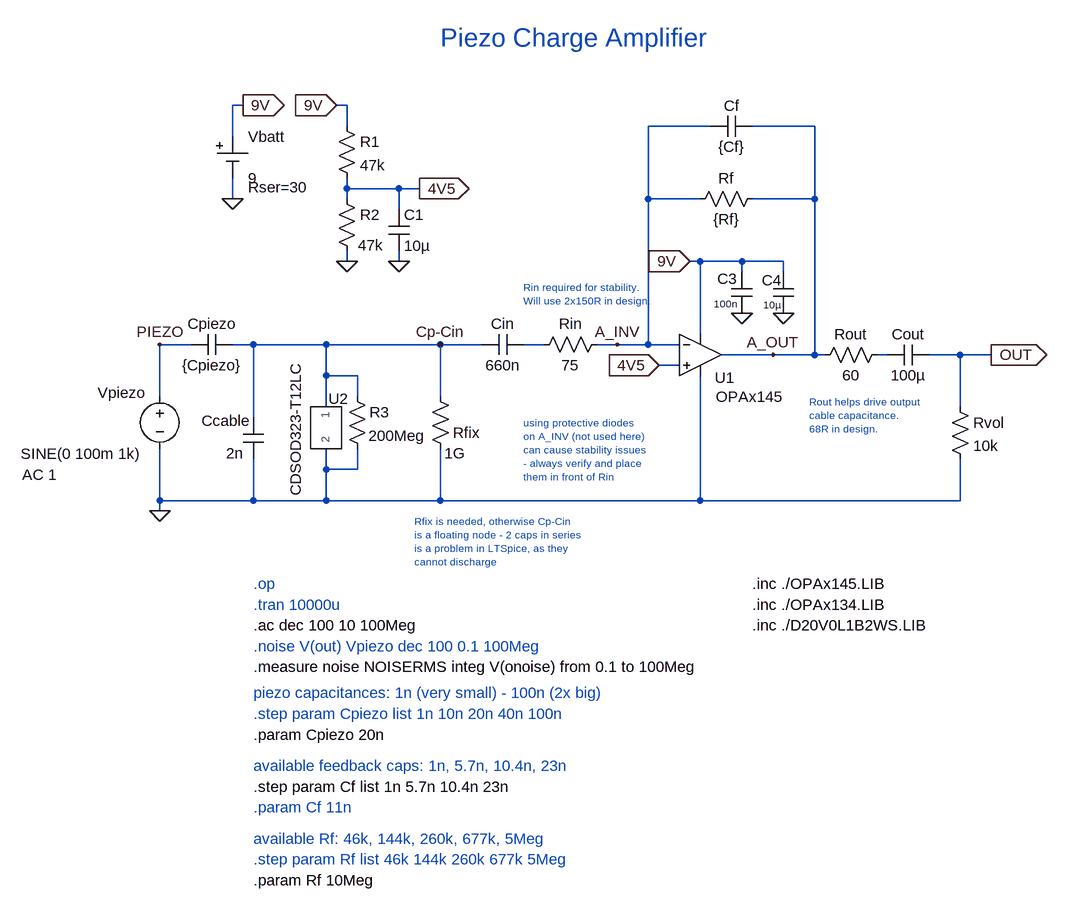
[diagram p0: schematic simulation-charge_amp_only.asc]
simulation-charge_amp_only.asc, the LTspice schematic file:
Version 4
SHEET 1 2856 1128
WIRE -272 -80 -288 -80
WIRE -112 -80 -128 -80
WIRE -112 -48 -112 -80
WIRE 448 -48 352 -48
WIRE 608 -48 512 -48
WIRE -288 -32 -288 -80
WIRE -112 48 -112 32
WIRE -32 48 -112 48
WIRE 0 48 -32 48
WIRE -288 64 -288 32
WIRE -112 64 -112 48
WIRE 352 64 352 -48
WIRE 432 64 352 64
WIRE 608 64 608 -48
WIRE 608 64 512 64
WIRE -32 80 -32 48
WIRE -112 160 -112 144
WIRE -32 160 -32 144
WIRE -16 160 -32 160
WIRE 432 160 416 160
WIRE 496 160 432 160
WIRE 560 160 496 160
WIRE 496 176 496 160
WIRE 560 176 560 160
WIRE 432 272 432 160
WIRE -352 288 -400 288
WIRE -256 288 -288 288
WIRE -144 288 -256 288
WIRE 32 288 -144 288
WIRE 96 288 32 288
WIRE 192 288 160 288
WIRE 304 288 272 288
WIRE 352 288 352 64
WIRE 352 288 304 288
WIRE 400 288 352 288
WIRE 544 304 464 304
WIRE 608 304 608 64
WIRE 608 304 544 304
WIRE 624 304 608 304
WIRE 720 304 704 304
WIRE 832 304 784 304
WIRE 880 304 832 304
WIRE 400 320 368 320
WIRE -144 336 -144 288
WIRE -96 336 -144 336
WIRE -400 368 -400 288
WIRE -96 368 -96 336
WIRE 32 368 32 288
WIRE -144 384 -144 336
WIRE 832 384 832 304
WIRE -256 400 -256 288
WIRE -144 480 -144 448
WIRE -96 480 -96 448
WIRE -96 480 -144 480
WIRE -400 528 -400 448
WIRE -256 528 -256 464
WIRE -256 528 -400 528
WIRE -144 528 -144 480
WIRE -144 528 -256 528
WIRE 32 528 32 448
WIRE 32 528 -144 528
WIRE 432 528 432 336
WIRE 432 528 32 528
WIRE 832 528 832 464
WIRE 832 528 432 528
WIRE -400 544 -400 528
FLAG 880 304 OUT
IOPIN 880 304 Out
FLAG -288 64 0
FLAG 304 288 A_INV
FLAG -400 544 0
FLAG 544 304 A_OUT
FLAG -400 288 PIEZO
FLAG 416 160 9V
IOPIN 416 160 In
FLAG 496 240 0
FLAG 560 240 0
FLAG 0 48 4V5
IOPIN 0 48 Out
FLAG -112 160 0
FLAG -32 160 0
FLAG -128 -80 9V
IOPIN -128 -80 In
FLAG 32 288 Cp-Cin
FLAG -272 -80 9V
IOPIN -272 -80 Out
FLAG 368 320 4V5
IOPIN 368 320 In
SYMBOL Res 528 48 R90
WINDOW 0 0 56 VBottom 2
WINDOW 3 32 56 VTop 2
SYMATTR InstName Rf
SYMATTR Value {Rf}
SYMBOL Cap 512 -64 R90
WINDOW 0 0 32 VBottom 2
WINDOW 3 32 32 VTop 2
SYMATTR InstName Cf
SYMATTR Value {Cf}
SYMBOL Cap -288 272 R90
WINDOW 0 0 32 VBottom 2
WINDOW 3 32 32 VTop 2
SYMATTR InstName Cpiezo
SYMATTR Value {Cpiezo}
SYMBOL Cap 784 288 R90
WINDOW 0 0 32 VBottom 2
WINDOW 3 32 32 VTop 2
SYMATTR InstName Cout
SYMATTR Value 100µ
SYMBOL voltage -400 352 R0
WINDOW 0 -96 10 Left 2
WINDOW 3 -214 104 Left 2
WINDOW 123 -212 136 Left 2
SYMATTR InstName Vpiezo
SYMATTR Value SINE(0 100m 1k)
SYMATTR Value2 AC 1
SYMBOL Res 816 368 R0
SYMATTR InstName Rvol
SYMATTR Value 10k
SYMBOL Opamps/opamp2 432 240 R0
WINDOW 0 22 99 Left 2
WINDOW 3 24 128 Left 2
SYMATTR InstName U1
SYMATTR Value OPAx145
SYMBOL Cap 480 176 R0
WINDOW 0 -22 11 Left 2
WINDOW 3 -27 49 Left 1
SYMATTR InstName C3
SYMATTR Value 100n
SYMBOL Cap 544 176 R0
WINDOW 0 -17 13 Left 2
WINDOW 3 -15 51 Left 1
SYMATTR InstName C4
SYMATTR Value 10µ
SYMBOL Res 16 352 R0
WINDOW 0 35 72 Left 2
WINDOW 3 22 103 Left 2
SYMATTR InstName Rfix
SYMATTR Value 1G
SYMBOL Cap 160 272 R90
WINDOW 0 0 32 VBottom 2
WINDOW 3 32 32 VTop 2
SYMATTR InstName Cin
SYMATTR Value 660n
SYMBOL Res -128 -64 R0
SYMATTR InstName R1
SYMATTR Value 47k
SYMBOL Res -128 48 R0
WINDOW 3 33 87 Left 2
SYMATTR Value 47k
SYMATTR InstName R2
SYMBOL Cap -48 80 R0
SYMATTR InstName C1
SYMATTR Value 10µ
SYMBOL Misc/cell -288 -32 R0
WINDOW 39 24 78 Left 2
SYMATTR SpiceLine Rser=30
SYMATTR InstName Vbatt
SYMATTR Value 9
SYMBOL Res 720 288 R90
WINDOW 0 0 56 VBottom 2
WINDOW 3 32 56 VTop 2
SYMATTR InstName Rout
SYMATTR Value 60
SYMBOL Res 288 272 R90
WINDOW 0 0 56 VBottom 2
WINDOW 3 32 56 VTop 2
SYMATTR InstName Rin
SYMATTR Value 75
SYMBOL Cap -272 400 R0
WINDOW 0 -64 5 Left 2
WINDOW 3 -26 55 Left 2
SYMATTR InstName Ccable
SYMATTR Value 2n
SYMBOL CDSOD323-T12LC -144 416 R90
WINDOW 0 -60 -19 VTop 2
WINDOW 3 1 31 Top 2
SYMATTR InstName U2
SYMBOL Res -112 352 R0
WINDOW 0 35 40 Left 2
WINDOW 3 33 76 Left 2
SYMATTR InstName R3
SYMATTR Value 200Meg
TEXT -256 688 Left 2 ;.tran 10000u
TEXT -8 560 Left 1 ;Rfix is needed, otherwise Cp-Cin\nis a floating node - 2 caps in series \nis a problem in LTSpice, as they \ncannot discharge
TEXT 512 656 Left 2 !.inc ./OPAx145.LIB
TEXT -256 656 Left 2 ;.op
TEXT 32 -184 Left 4 ;Piezo Charge Amplifier
TEXT -256 720 Left 2 !.ac dec 100 10 100Meg
TEXT 512 688 Left 2 !.inc ./OPAx134.LIB
TEXT -256 752 Left 2 ;.noise V(out) Vpiezo dec 100 0.1 100Meg
TEXT -256 856 Left 2 ;.step param Cpiezo list 1n 10n 20n 40n 100n
TEXT -256 968 Left 2 !.step param Cf list 1n 5.7n 10.4n 23n
TEXT -256 1080 Left 2 ;.step param Rf list 46k 144k 260k 677k 5Meg
TEXT -256 824 Left 2 ;piezo capacitances: 1n (very small) - 100n (2x big)
TEXT -256 936 Left 2 ;available feedback caps: 1n, 5.7n, 10.4n, 23n
TEXT -256 1048 Left 2 ;available Rf: 46k, 144k, 260k, 677k, 5Meg
TEXT 160 408 Left 1 ;using protective diodes\non A_INV (not used here)\ncan cause stability issues \n- always verify and place \nthem in front of Rin
TEXT 160 200 Left 1 ;Rin required for stability.\nWill use 2x150R in design.
TEXT 600 376 Left 1 ;Rout helps drive output\ncable capacitance.\n68R in design.
TEXT -256 888 Left 2 !.param Cpiezo 20n
TEXT -256 1000 Left 2 ;.param Cf 11n
TEXT -256 1112 Left 2 !.param Rf 10Meg
TEXT 512 720 Left 2 !.inc ./D20V0L1B2WS.LIB
TEXT -256 784 Left 2 !.measure noise NOISERMS integ V(onoise) from 0.1 to 100Meg

The netlist it stands for:
* simulation-charge_amp_only.asc
Rf A_OUT A_INV {Rf}
Cf A_OUT A_INV {Cf}
Cpiezo Cp-Cin PIEZO {Cpiezo}
Cout OUT N002 100µ
Vpiezo PIEZO 0 SINE(0 100m 1k) AC 1
Rvol OUT 0 10k
XU1 4V5 A_INV 9V 0 A_OUT OPAx145  ; pins In+ In- V+ V- OUT
C3 9V 0 100n
C4 9V 0 10µ
Rfix Cp-Cin 0 1G
Cin N001 Cp-Cin 660n
R1 9V 4V5 47k
R2 4V5 0 47k
C1 4V5 0 10µ
Vbatt 9V 0 9 Rser=30
Rout N002 A_OUT 60
Rin A_INV N001 75
Ccable Cp-Cin 0 2n
XU2 Cp-Cin 0 CDSOD323-T12LC  ; pins 1 2
R3 Cp-Cin 0 200Meg
* .tran 10000u
* Rfix is needed, otherwise Cp-Cin
* is a floating node - 2 caps in series
* is a problem in LTSpice, as they
* cannot discharge
.inc ./OPAx145.LIB
* .op
* Piezo Charge Amplifier
.ac dec 100 10 100Meg
.inc ./OPAx134.LIB
* .noise V(out) Vpiezo dec 100 0.1 100Meg
* .step param Cpiezo list 1n 10n 20n 40n 100n
.step param Cf list 1n 5.7n 10.4n 23n
* .step param Rf list 46k 144k 260k 677k 5Meg
* piezo capacitances: 1n (very small) - 100n (2x big)
* available feedback caps: 1n, 5.7n, 10.4n, 23n
* available Rf: 46k, 144k, 260k, 677k, 5Meg
* using protective diodes
* on A_INV (not used here)
* can cause stability issues
* - always verify and place
* them in front of Rin
* Rin required for stability.
* Will use 2x150R in design.
* Rout helps drive output
* cable capacitance.
* 68R in design.
.param Cpiezo 20n
* .param Cf 11n
.param Rf 10Meg
.inc ./D20V0L1B2WS.LIB
.measure noise NOISERMS integ V(onoise) from 0.1 to 100Meg
.lib CDSOD323-T12LC.LIB
.backanno
.end